# EAGLE schematic ArtNet_Node_v2 (EAGLE 7.0.0)
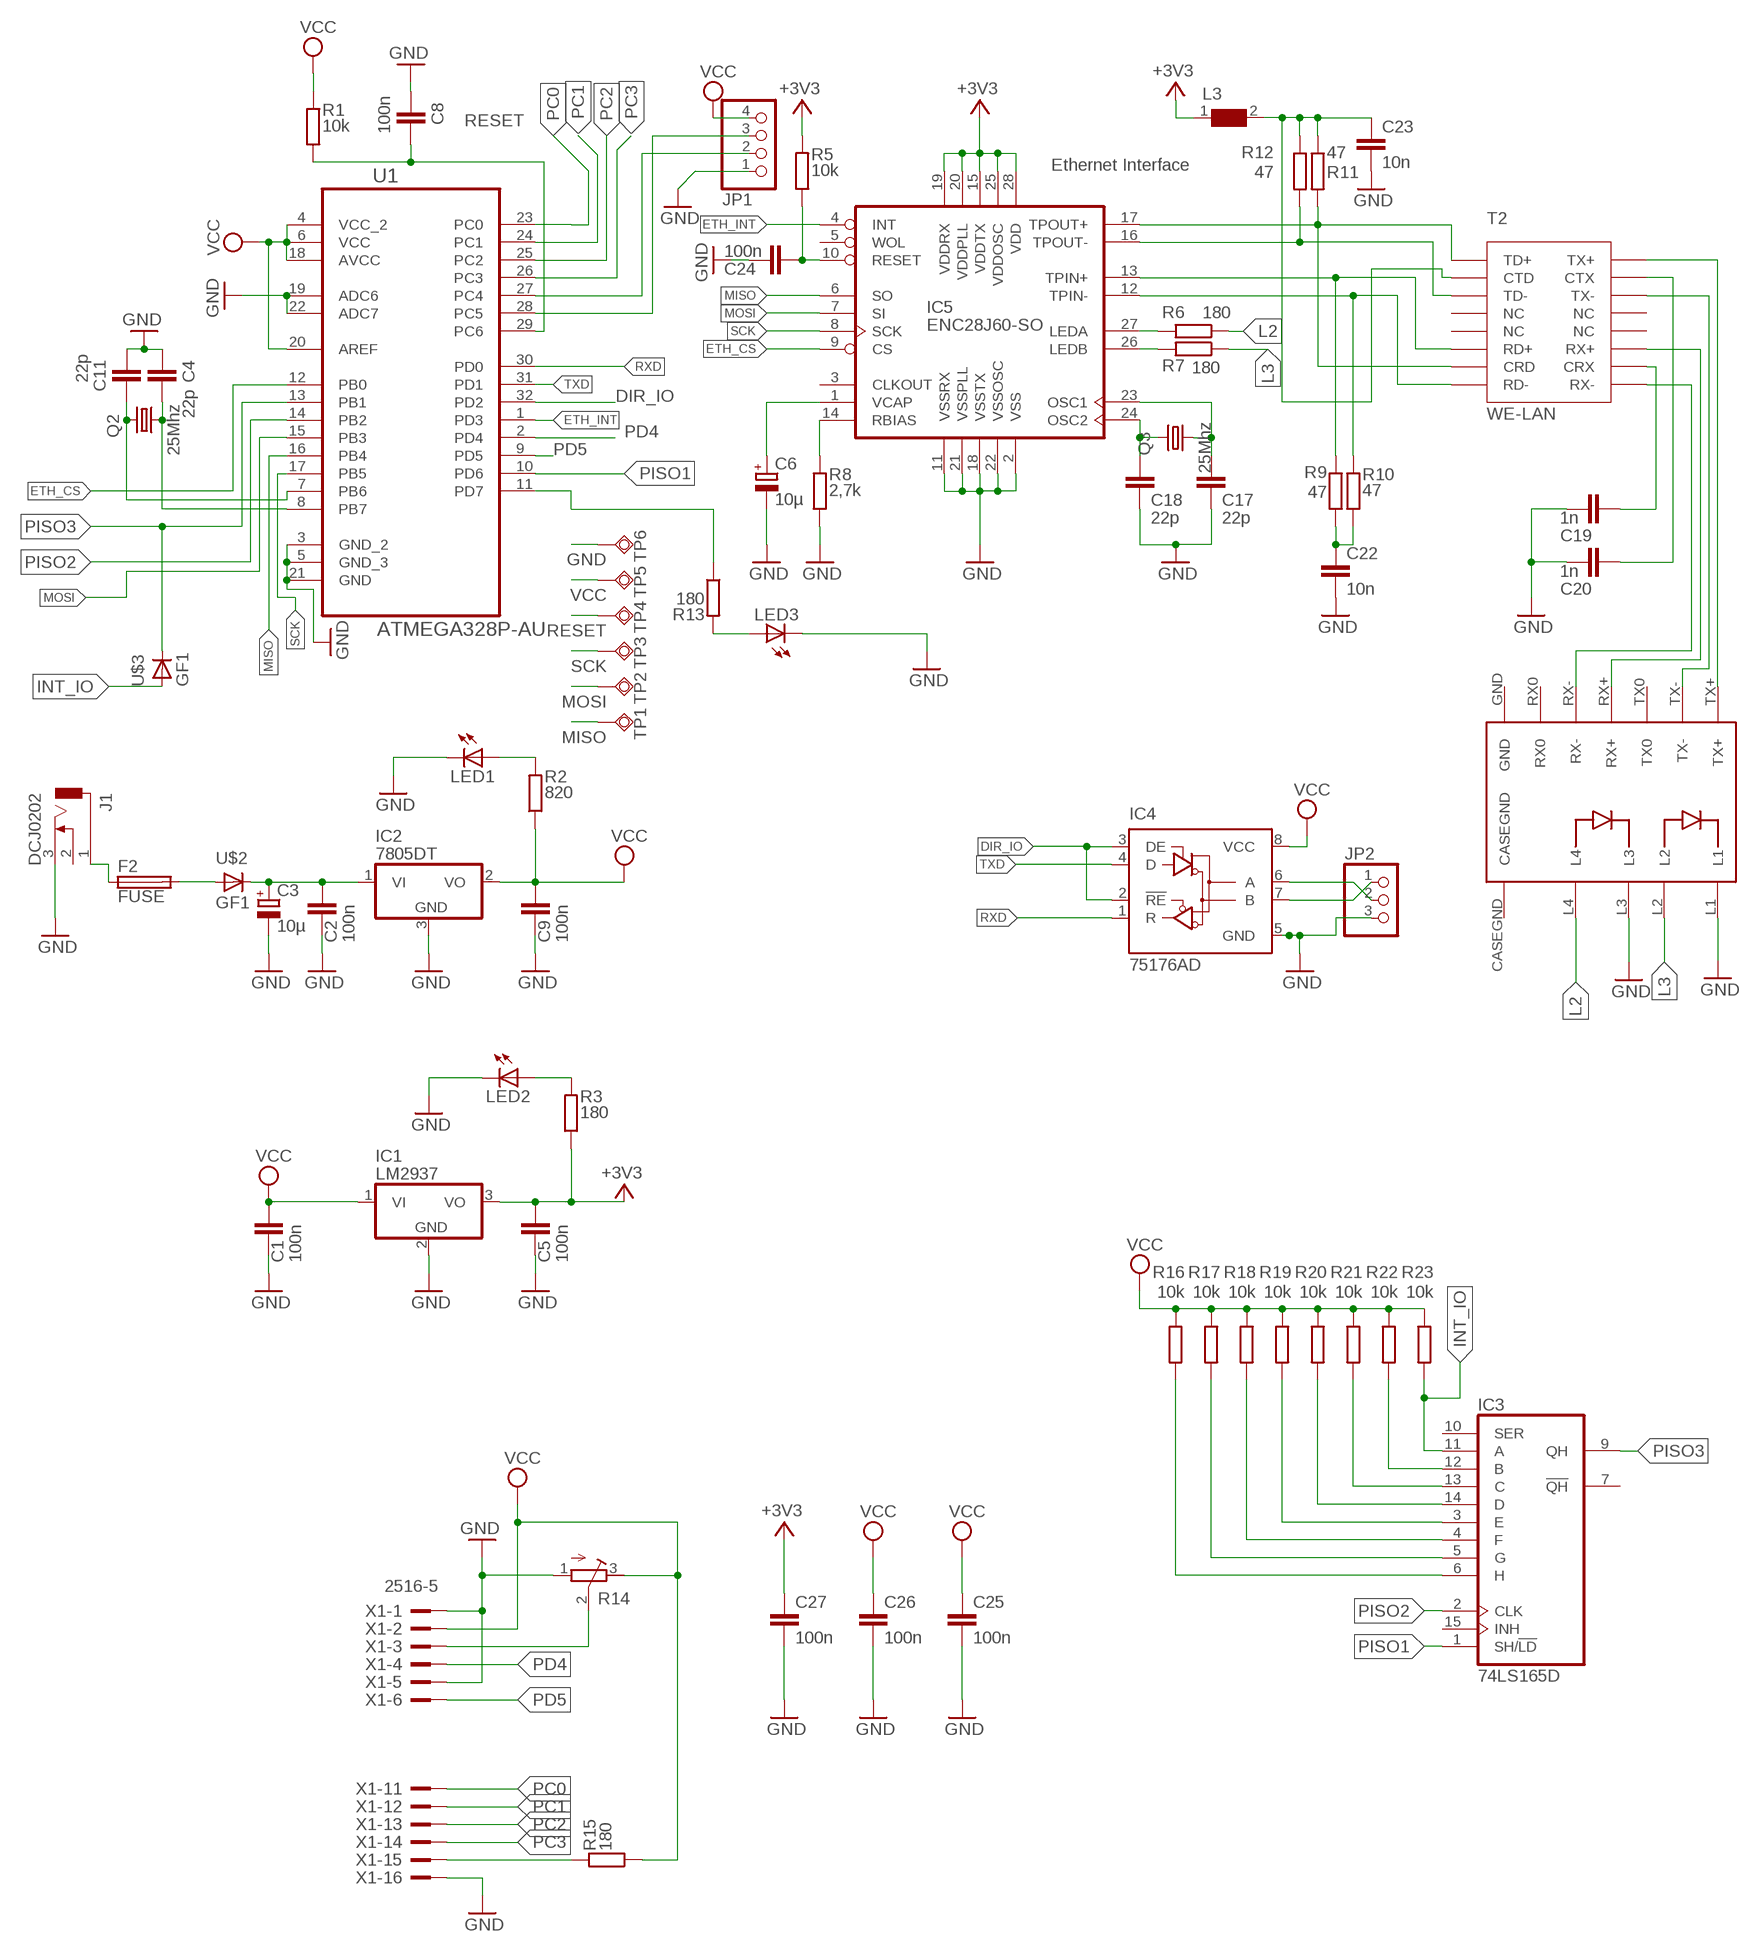
[diagram p0: schematic, sheet 1]

## Parts
C1  100n  C-EUC1206  [C1206]
C2  100n  C-EUC1206  [C1206]
C3  10µ  CPOL-EUUD-5X5,8  [UD-5X5,8_NICHICON]
C4  22p  C-EUC1206  [C1206]
C5  100n  C-EUC1206  [C1206]
C6  10µ  CPOL-EUUD-5X5,8  [UD-5X5,8_NICHICON]
C8  100n  C-EUC1206  [C1206]
C9  100n  C-EUC1206  [C1206]
C11  22p  C-EUC1206  [C1206]
C17  22p  C-EUC1206  [C1206]
C18  22p  C-EUC1206  [C1206]
C19  1n  C-EUC1206  [C1206]
C20  1n  C-EUC1206  [C1206]
C22  10n  C-EUC1206  [C1206]
C23  10n  C-EUC1206  [C1206]
C24  100n  C-EUC1206  [C1206]
C25  100n  C-EUC1206  [C1206]
C26  100n  C-EUC1206  [C1206]
C27  100n  C-EUC1206  [C1206]
F2  FUSE  SMD-MICRO-FUSE-BLOCK  [OMNIBLOK]
IC1  LM2937  [TO263-3]
IC2  7805DT  [TO252]
IC3  74LS165D  [SO16]
IC4  75176AD  [D_R-PDSO-G8]
IC5  ENC28J60-SO  [SO28W]
J1  DCJ0202  [DCJ0202]
JP1  PINHD-1X4  [1X04]
JP2  PINHD-1X3  [1X03]
L3  WE-SMD_7427930  [WE-SMD_7427930]
LED1  LEDSML1206  [SML1206]
LED2  LEDSML1206  [SML1206]
LED3  LEDSMT1206  [1206]
Q2  25Mhz  CRYTALMM20SS  [MM20SS]
Q3  25Mhz  CRYTALMM20SS  [MM20SS]
R1  10k  R-EU_M1206  [M1206]
R2  820  R-EU_M1206  [M1206]
R3  180  R-EU_M1206  [M1206]
R5  10k  R-EU_M1206  [M1206]
R6  180  R-EU_M1206  [M1206]
R7  180  R-EU_M1206  [M1206]
R8  2,7k  R-EU_M1206  [M1206]
R9  47  R-EU_M1206  [M1206]
R10  47  R-EU_M1206  [M1206]
R11  47  R-EU_M1206  [M1206]
R12  47  R-EU_M1206  [M1206]
R13  180  R-EU_M1206  [M1206]
R14  R-TRIMMTS63X  [RTRIMTS63X]
R15  180  R-EU_M1206  [M1206]
R16  10k  R-EU_M1206  [M1206]
R17  10k  R-EU_M1206  [M1206]
R18  10k  R-EU_M1206  [M1206]
R19  10k  R-EU_M1206  [M1206]
R20  10k  R-EU_M1206  [M1206]
R21  10k  R-EU_M1206  [M1206]
R22  10k  R-EU_M1206  [M1206]
R23  10k  R-EU_M1206  [M1206]
T2  WE-LAN  WE-LAN_10/100_BASETX_7490100111  [WE-LAN_10/100_BASETX_7490100111]
TP1  TPSQTP20SQ  [TP20SQ]
TP2  TPSQTP20SQ  [TP20SQ]
TP3  TPSQTP20SQ  [TP20SQ]
TP4  TPSQTP20SQ  [TP20SQ]
TP5  TPSQTP20SQ  [TP20SQ]
TP6  TPSQTP20SQ  [TP20SQ]
U1  ATMEGA328P-AU  [QFP80P900X900X120-32N]
U$1  1XRJ45_MM_JACK  [1XRJ45_MM_JACK]
U$2  GF1  [SMA-DO214AC]
U$3  GF1  [SMA-DO214AC]
X1  2516-5  [PAK100/2500-5-16]

## Nets
+3V3: C5.2 C27.1 IC1.3(VO) IC5.15(VDDTX) IC5.19(VDDRX) IC5.20(VDDPLL) IC5.25(VDDOSC) IC5.28(VDD) L3.1 R3.1 R5.2
DIR_IO: IC4.2(!RE) IC4.3(DE) U1.32(PD2)
ETH_CS: IC5.9(CS) U1.12(PB0)
ETH_INT: IC5.4(INT) U1.1(PD3)
GND: C1.1 C2.1 C3.- C4.2 C5.1 C6.- C8.2 C9.1 C11.2 C17.1 C18.1 C19.2 C20.2 C22.2 C23.2 C24.1 C25.1 C26.2 C27.2 IC1.2(GND) IC2.3(GND) IC4.5(GND) IC5.2(VSS) IC5.11(VSSRX) IC5.18(VSSTX) IC5.21(VSSPLL) IC5.22(VSSOSC) J1.3 JP1.1 JP2.3 LED1.C LED2.C LED3.C R8.1 R14.1(E) TP6.TP U1.3(GND_2) U1.5(GND_3) U1.19(ADC6) U1.21(GND) U1.22(ADC7) U$1.L1 U$1.L3 X1.1 X1.5 X1.16
INT_IO: IC3.11(A) R23.2 U$3.A
L2: R6.1 U$1.L4
L3: R7.1 U$1.L2
MISO: IC5.6(SO) TP1.TP U1.16(PB4)
MOSI: IC5.7(SI) TP2.TP U1.15(PB3)
N$1: T2.16(TX+) U$1.TX+
N$2: C19.1 T2.10(CRX)
N$3: T2.14(TX-) U$1.TX-
N$4: C20.1 T2.15(CTX)
N$6: F2.P$2 U$2.A
N$7: T2.11(RX+) U$1.RX+
N$8: T2.9(RX-) U$1.RX-
N$9: IC4.7(B) JP2.1
N$10: F2.P$1 J1.1
N$11: IC5.27(LEDA) R6.2
N$12: JP1.2 U1.27(PC4)
N$13: IC4.6(A) JP2.2
N$14: IC5.26(LEDB) R7.2
N$15: C2.2 C3.+ IC2.1(VI) U$2.K(C)
N$16: LED2.A R3.2
N$20: C18.2 IC5.24(OSC2) Q3.4
N$21: C17.2 IC5.23(OSC1) Q3.1
N$22: IC5.12(TPIN-) R10.2 T2.8(RD-)
N$23: IC5.13(TPIN+) R9.2 T2.6(RD+)
N$24: IC5.16(TPOUT-) R12.2 T2.3(TD-)
N$25: IC5.17(TPOUT+) R11.2 T2.1(TD+) T2.7(CRD)
N$26: IC5.14(RBIAS) R8.2
N$27: C6.+ IC5.1(VCAP)
N$28: JP1.3 U1.28(PC5)
N$29: C22.1 R9.1 R10.1
N$30: C24.2 IC5.10(RESET) R5.1
N$31: LED1.A R2.2
N$33: R13.1 U1.11(PD7)
N$34: R14.2(S) X1.3
N$35: LED3.A R13.2
N$38: R15.2 X1.15
N$39: IC3.12(B) R22.2
N$40: IC3.13(C) R21.2
N$41: IC3.14(D) R20.2
N$42: IC3.3(E) R19.2
N$43: IC3.4(F) R18.2
N$44: IC3.5(G) R17.2
N$45: IC3.6(H) R16.2
N$54: C4.1 Q2.1 U1.8(PB7)
N$55: C11.1 Q2.4 U1.7(PB6)
N$248: C23.1 L3.2 R11.1 R12.1 T2.2(CTD)
PC0: U1.23(PC0) X1.11
PC1: U1.24(PC1) X1.12
PC2: U1.25(PC2) X1.13
PC3: U1.26(PC3) X1.14
PD4: U1.2(PD4) X1.4
PD5: U1.9(PD5) X1.6
PISO1: IC3.1(SH/!LD) U1.10(PD6)
PISO2: IC3.2(CLK) U1.14(PB2)
PISO3: IC3.9(QH) U1.13(PB1) U$3.K(C)
RESET: C8.1 R1.1 TP4.TP U1.29(PC6)
RXD: IC4.1(R) U1.30(PD0)
SCK: IC5.8(SCK) TP3.TP U1.17(PB5)
TXD: IC4.4(D) U1.31(PD1)
VCC: C1.2 C9.2 C25.2 C26.1 IC1.1(VI) IC2.2(VO) IC4.8(VCC) JP1.4 R1.2 R2.1 R14.3(A) R15.1 R16.1 R17.1 R18.1 R19.1 R20.1 R21.1 R22.1 R23.1 TP5.TP U1.4(VCC_2) U1.6(VCC) U1.18(AVCC) U1.20(AREF) X1.2
Unconnected: IC3.7(!QH) IC3.10(SER) IC3.15(INH) IC5.3(CLKOUT) IC5.5(WOL) J1.2 T2.4(NC) T2.5(NC) T2.12(NC) T2.13(NC) U$1.CASEGND U$1.GND U$1.RX0 U$1.TX0 X1.7 X1.8 X1.9 X1.10

## Notes on the sheet
- Ethernet Interface

## Power pins joined to a net without a drawn wire
GND: IC3.8(GND)
VCC: IC3.16(VCC)

## Library data of the parts
C1 C2 C4 C5 C8 C9 C11 C17-C20 C22-C27 = rcl:C-EU: CAPACITOR, European symbol
C3 C6 = rcl:CPOL-EU: POLARIZED CAPACITOR, European symbol
F2 = f-lf-omniblok-s:SMD-MICRO-FUSE
IC1 = linear:LM2937: LM2937-2.5, LM2937-3.3 400mA and 500mA Voltage Regulators Source: http://cache.national.com/ds/LM/LM2937-2.5.pdf
IC2 = linear:78*: Positive VOLTAGE REGULATOR Source: http://cache.national.com/ds/LM/LM78L05.pdf http://www.fairchildsemi.com/ds/LM/LM7805.pdf
IC3 = 74xx-us:74*165: 8-bit parallel load SHIFT REGISTER
IC4 = 751xx:75176A: DIFFERENTIAL BUS TRANSCEIVER Source: http://focus.ti.com/lit/ds/symlink/sn75176a.pdf
IC5 = enc28j60centered:ENC28J60-*: Microchip 10Mbit Ethernet controller with SPI interface Improved SOIC28 layout (pads in 0.01 raster, pin1 slightly smaller). Pin 6 (SO) changed from Out (paralleling several Outs gives an error) to OC. Author: Profi from mikrocontroller.net - forum Date: 2006.0827
J1 = con-jack:DCJ0202: DC POWER JACK Source: DCJ0202.pdf; OC_FARNELL: unknown; OC_NEWARK: unknown
JP1 = pinhead:PINHD-1X4: PIN HEADER
JP2 = pinhead:PINHD-1X3: PIN HEADER
L3 = wuerth_elektronik_eisos__v6.5:WE-SMD: SMD EMI Suppression Ferrite Beads (High Current) For applications where you need low DC resistance
LED1-LED3 = led:LED: LED OSRAM: - CHIPLED LG R971, LG N971, LY N971, LG Q971, LY Q971, LO R971, LY R971 LH N974, LH R974 LS Q976, LO Q976, LY Q976 LO Q996 - Hyper CHIPLED LW Q18S LB Q993, LB Q99A, LB R99A - SideLED LS A670, LO A670, LY A670, LG A670, LP A670 LB A673, LV A673, LT A673, LW A673 LH A674 LY A675 LS A676, LA A676, LO A676, LY A676, LW A676 LS A679, LY A679, LG A679 - Hyper Micro SIDELED® LS Y876, LA Y876, LO Y876, LY Y876 LT Y87S - SmartLED LW L88C, LW L88S LB L89C, LB L89S, LG L890 LS L89K, LO L89K, LY L89K LS L896, LA L896, LO L896, LY L896 - TOPLED LS T670, LO T670, LY T670, LG T670, LP T670 LSG T670, LSP T670, LSY T670, LOP T670, LYG T670 LG T671, LOG T671, LSG T671 LB T673, LV T673, LT T673, LW T673 LH T674 LS T676, LA T676, LO T676, LY T676, LB T676, LH T676, LSB T676, LW T676 LB T67C, LV T67C, LT T67C, LS T67K, LO T67K, LY T67K, LW E67C LS E67B, LA E67B, LO E67B, LY E67B, LB E67C, LV E67C, LT E67C LW T67C LS T679, LY T679, LG T679 LS T770, LO T770, LY T770, LG T770, LP T770 LB T773, LV T773, LT T773, LW T773 LH T774 LS E675, LA E675, LY E675, LS T675 LS T776, LA T776, LO T776, LY T776, LB T776 LHGB T686 LT T68C, LB T68C - Hyper Mini TOPLED® LB M676 - Mini TOPLED Santana® LG M470 LS M47K, LO M47K, LY M47K Source: http://www.osram.convergy.de LUXEON: - LUMILED® LXK2-PW12-R00, LXK2-PW12-S00, LXK2-PW14-U00, LXK2-PW14-V00 LXK2-PM12-R00, LXK2-PM12-S00, LXK2-PM14-U00 LXK2-PE12-Q00, LXK2-PE12-R00, LXK2-PE12-S00, LXK2-PE14-T00, LXK2-PE14-U00 LXK2-PB12-K00, LXK2-PB12-L00, LXK2-PB12-M00, LXK2-PB14-N00, LXK2-PB14-P00, LXK2-PB14-Q00 LXK2-PR12-L00, LXK2-PR12-M00, LXK2-PR14-Q00, LXK2-PR14-R00 LXK2-PD12-Q00, LXK2-PD12-R00, LXK2-PD12-S00 LXK2-PH12-R00, LXK2-PH12-S00 LXK2-PL12-P00, LXK2-PL12-Q00, LXK2-PL12-R00 Source: www.luxeon.com KINGBRIGHT: KA-3528ASYC Source: www.kingbright.com
Q2 Q3 = crystal:CRYTAL: CRYSTAL
R1-R3 R5-R13 R15-R23 = rcl:R-EU_: RESISTOR, European symbol
R14 = resistor:R-TRIMM: Trimm resistor
T2 = wuerth_elektronik_eisos__v6.5:WE-LAN_10/100_BASETX_7490100111: LAN-Transformer WE-LAN 10/100 Base Tx - Compliant with IEEE 802.3 standards - SMD -- Ethernet -- Power over Ethernet -- 1 Gigabit Ethernet -- Compliant with most IC's for ethernet applications like Intel, AMD, Globespan and Realtek -- Hub, Router, Switch
TP1-TP6 = testpad:TPSQ: Test pad
U1 = Atmel_By_element14_Batch_1-00:ATMEGA328P-AU: 8-bit Microcontroller with In-System Programmable Flash; MPN: ATMEGA328P-AU; OC_FARNELL: 1715486; OC_NEWARK: 14R4631; PACKAGE: TQFP-32; SUPPLIER: Atmel
U$1 = con-ppt_prj006:1XRJ45_MM_JACK: PPT PRJ-006
U$2 U$3 = diode:GF1: DIODE
X1 = con-3m:2516-: 3M (TM) Pak 100 4-Wall Header Source: 3M; MPN: D2516-5002-AR; OC_FARNELL: 9838376; OC_NEWARK: 12P7055

## Net classes
0 default: clearance 0.205 mm